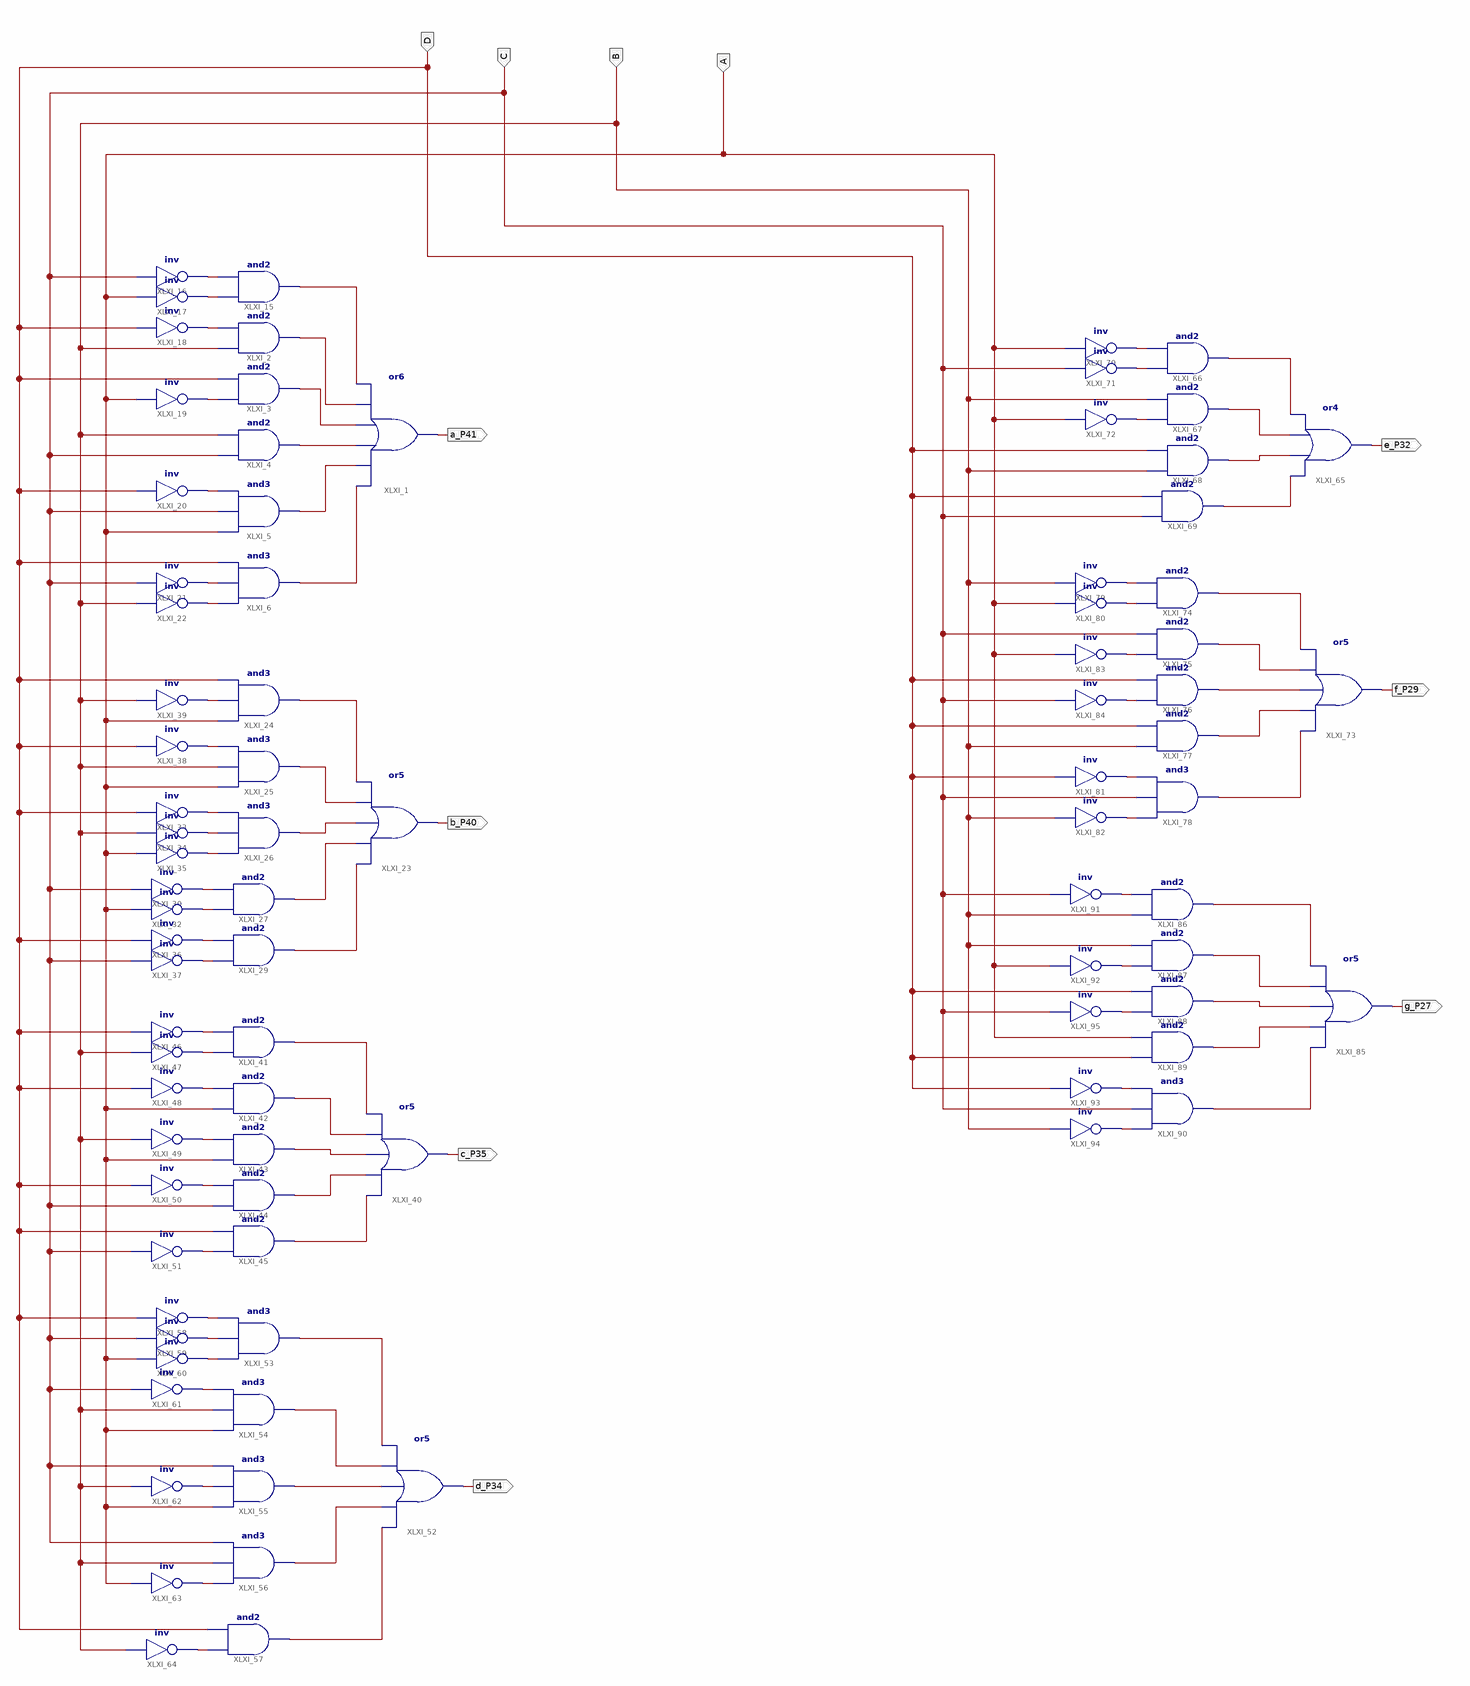
[diagram p0: schematic sheet 1]
// Xilinx ISE schematic sevseg.sch (spartan6) as structural Verilog: 85 symbols, 11 ports
module sevseg (
  input  A,
  input  B,
  input  C,
  input  D,
  output a_P41,
  output b_P40,
  output c_P35,
  output d_P34,
  output e_P32,
  output f_P29,
  output g_P27
);

  wire XLXN_5, XLXN_6, XLXN_7, XLXN_8, XLXN_9, XLXN_10, XLXN_11, XLXN_12, XLXN_13, XLXN_14, XLXN_15, XLXN_16,
       XLXN_17, XLXN_36, XLXN_37, XLXN_38, XLXN_39, XLXN_40, XLXN_41, XLXN_42, XLXN_43, XLXN_44, XLXN_45,
       XLXN_46, XLXN_47, XLXN_48, XLXN_49, XLXN_63, XLXN_64, XLXN_65, XLXN_66, XLXN_67, XLXN_68, XLXN_69,
       XLXN_70, XLXN_71, XLXN_72, XLXN_73, XLXN_85, XLXN_86, XLXN_87, XLXN_88, XLXN_89, XLXN_90, XLXN_91,
       XLXN_92, XLXN_93, XLXN_94, XLXN_95, XLXN_96, XLXN_112, XLXN_113, XLXN_114, XLXN_115, XLXN_116,
       XLXN_117, XLXN_118, XLXN_128, XLXN_129, XLXN_130, XLXN_131, XLXN_132, XLXN_133, XLXN_134, XLXN_135,
       XLXN_136, XLXN_137, XLXN_138, XLXN_146, XLXN_147, XLXN_148, XLXN_149, XLXN_150, XLXN_151, XLXN_152,
       XLXN_153, XLXN_154, XLXN_155;

  and XLXI_2 (XLXN_6, B, XLXN_13);
  and XLXI_3 (XLXN_7, XLXN_14, D);
  and XLXI_4 (XLXN_8, C, B);
  and XLXI_5 (XLXN_9, A, C, XLXN_15);
  and XLXI_6 (XLXN_10, XLXN_17, XLXN_16, D);
  or XLXI_1 (a_P41, XLXN_10, XLXN_9, XLXN_8, XLXN_7, XLXN_6, XLXN_5);
  and XLXI_15 (XLXN_5, XLXN_12, XLXN_11);
  not XLXI_16 (XLXN_11, C);
  not XLXI_17 (XLXN_12, A);
  not XLXI_18 (XLXN_13, D);
  not XLXI_19 (XLXN_14, A);
  not XLXI_20 (XLXN_15, D);
  not XLXI_21 (XLXN_16, C);
  not XLXI_22 (XLXN_17, B);
  or XLXI_23 (b_P40, XLXN_40, XLXN_39, XLXN_38, XLXN_37, XLXN_36);
  and XLXI_24 (XLXN_36, A, XLXN_49, D);
  and XLXI_25 (XLXN_37, A, B, XLXN_48);
  and XLXI_26 (XLXN_38, XLXN_45, XLXN_44, XLXN_43);
  and XLXI_27 (XLXN_39, XLXN_42, XLXN_41);
  and XLXI_29 (XLXN_40, XLXN_47, XLXN_46);
  not XLXI_30 (XLXN_41, C);
  not XLXI_32 (XLXN_42, A);
  not XLXI_33 (XLXN_43, D);
  not XLXI_34 (XLXN_44, B);
  not XLXI_35 (XLXN_45, A);
  not XLXI_36 (XLXN_46, D);
  not XLXI_37 (XLXN_47, C);
  not XLXI_38 (XLXN_48, D);
  not XLXI_39 (XLXN_49, B);
  or XLXI_40 (c_P35, XLXN_67, XLXN_66, XLXN_65, XLXN_64, XLXN_63);
  and XLXI_41 (XLXN_63, XLXN_69, XLXN_68);
  and XLXI_42 (XLXN_64, A, XLXN_70);
  and XLXI_43 (XLXN_65, A, XLXN_71);
  and XLXI_44 (XLXN_66, C, XLXN_72);
  and XLXI_45 (XLXN_67, XLXN_73, D);
  not XLXI_46 (XLXN_68, D);
  not XLXI_47 (XLXN_69, B);
  not XLXI_48 (XLXN_70, D);
  not XLXI_49 (XLXN_71, B);
  not XLXI_50 (XLXN_72, D);
  not XLXI_51 (XLXN_73, C);
  or XLXI_52 (d_P34, XLXN_89, XLXN_88, XLXN_87, XLXN_86, XLXN_85);
  and XLXI_53 (XLXN_85, XLXN_92, XLXN_91, XLXN_90);
  and XLXI_54 (XLXN_86, A, B, XLXN_93);
  and XLXI_55 (XLXN_87, A, XLXN_94, C);
  and XLXI_56 (XLXN_88, XLXN_95, B, C);
  and XLXI_57 (XLXN_89, XLXN_96, D);
  not XLXI_58 (XLXN_90, D);
  not XLXI_59 (XLXN_91, C);
  not XLXI_60 (XLXN_92, A);
  not XLXI_61 (XLXN_93, C);
  not XLXI_62 (XLXN_94, B);
  not XLXI_63 (XLXN_95, A);
  not XLXI_64 (XLXN_96, B);
  or XLXI_65 (e_P32, XLXN_115, XLXN_114, XLXN_113, XLXN_112);
  and XLXI_66 (XLXN_112, XLXN_117, XLXN_116);
  and XLXI_67 (XLXN_113, XLXN_118, B);
  and XLXI_68 (XLXN_114, B, D);
  and XLXI_69 (XLXN_115, C, D);
  not XLXI_70 (XLXN_116, A);
  not XLXI_71 (XLXN_117, C);
  not XLXI_72 (XLXN_118, A);
  or XLXI_73 (f_P29, XLXN_132, XLXN_131, XLXN_130, XLXN_129, XLXN_128);
  and XLXI_74 (XLXN_128, XLXN_134, XLXN_133);
  and XLXI_75 (XLXN_129, XLXN_137, C);
  and XLXI_76 (XLXN_130, XLXN_138, D);
  and XLXI_77 (XLXN_131, B, D);
  and XLXI_78 (XLXN_132, XLXN_136, C, XLXN_135);
  not XLXI_79 (XLXN_133, B);
  not XLXI_80 (XLXN_134, A);
  not XLXI_81 (XLXN_135, D);
  not XLXI_82 (XLXN_136, B);
  not XLXI_83 (XLXN_137, A);
  not XLXI_84 (XLXN_138, C);
  or XLXI_85 (g_P27, XLXN_150, XLXN_149, XLXN_148, XLXN_147, XLXN_146);
  and XLXI_86 (XLXN_146, B, XLXN_151);
  and XLXI_87 (XLXN_147, XLXN_152, B);
  and XLXI_88 (XLXN_148, XLXN_155, D);
  and XLXI_89 (XLXN_149, D, A);
  and XLXI_90 (XLXN_150, XLXN_154, C, XLXN_153);
  not XLXI_91 (XLXN_151, C);
  not XLXI_92 (XLXN_152, A);
  not XLXI_93 (XLXN_153, D);
  not XLXI_94 (XLXN_154, B);
  not XLXI_95 (XLXN_155, C);
endmodule
